# Altium schematic sheet 10.SchDoc
size 297 x 209 mm
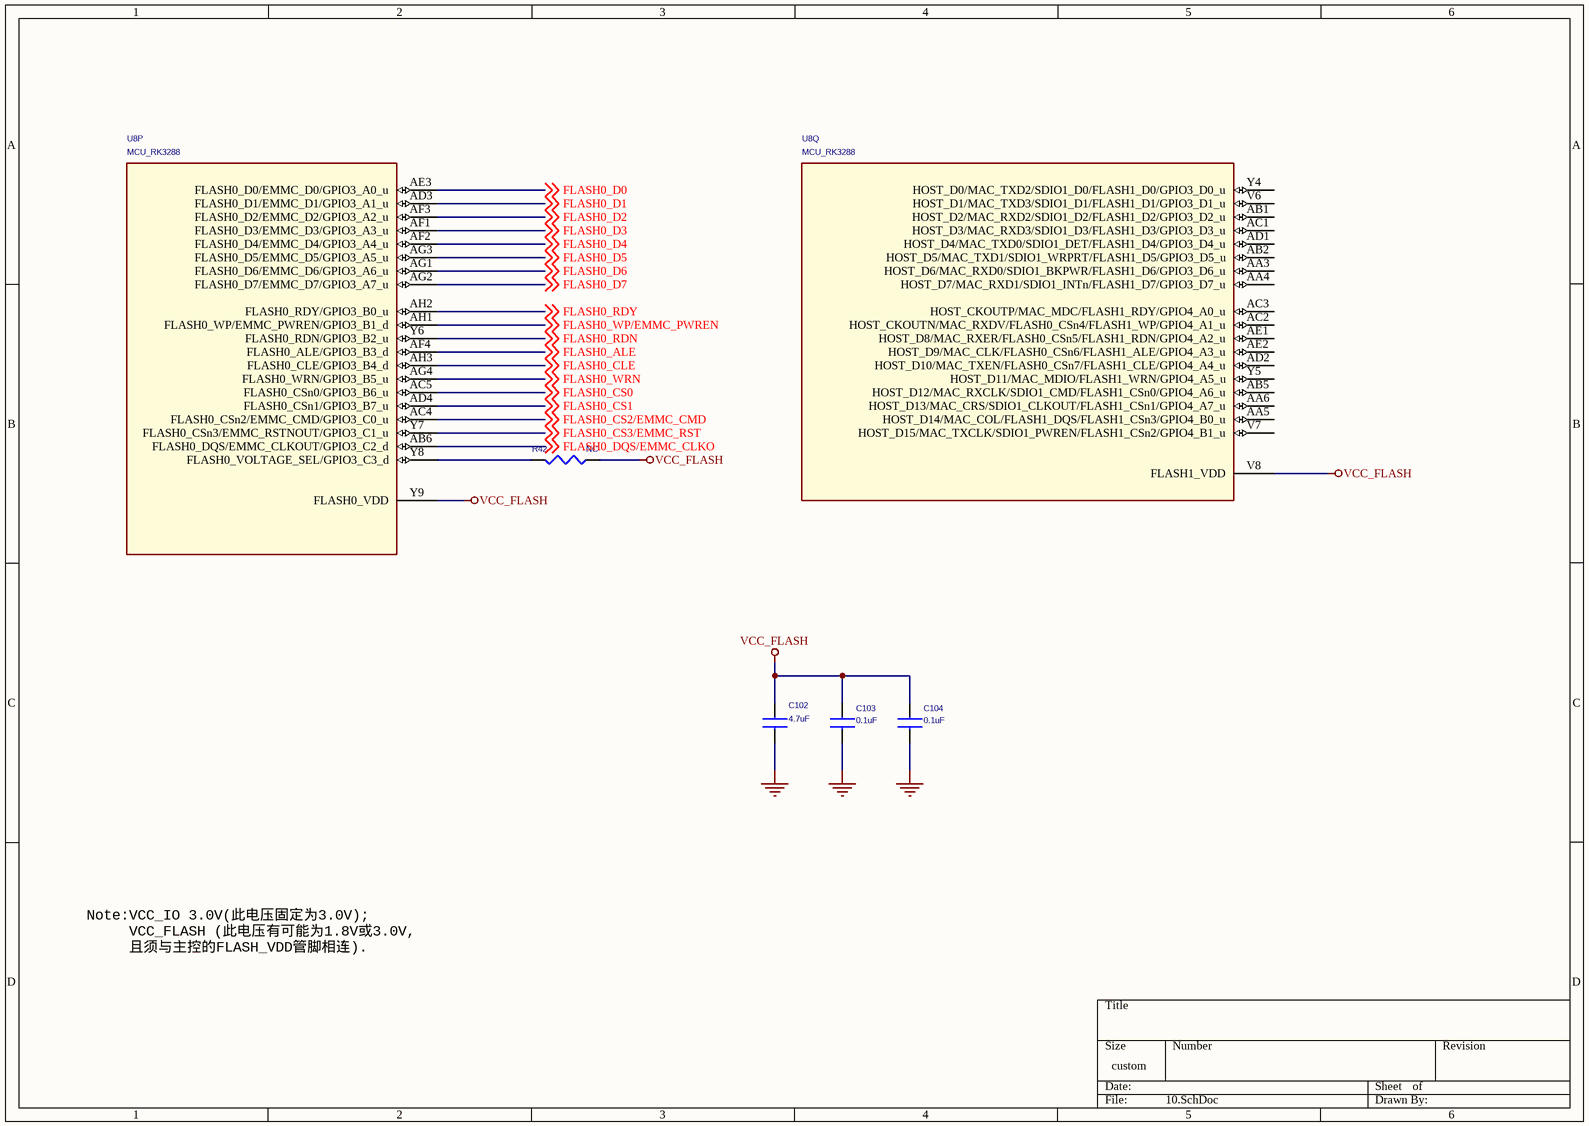
[diagram p0: 10.SchDoc]

## Parts
C102  4.7uF  [C0603]
C103  0.1uF  [C0603]
C104  0.1uF  [C0603]
R42  NC  [r0402]
U8  MCU_RK3288  [BGA453-19X19]  (parts P,Q of 24)

## Nets
GND: C102.2 C103.2 C104.2
VCC_FLASH: C102.1 C103.1 C104.1 R42.1 U8.V8(FLASH1_VDD) U8.Y9(FLASH0_VDD)
FLASH0_ALE: U8.AF4(FLASH0_ALE/GPIO3_B3_d) ; off-sheet FLASH0_ALE
FLASH0_CLE: U8.AH3(FLASH0_CLE/GPIO3_B4_d) ; off-sheet FLASH0_CLE
FLASH0_CS0: U8.AC5(FLASH0_CSn0/GPIO3_B6_u) ; off-sheet FLASH0_CS0
FLASH0_CS1: U8.AD4(FLASH0_CSn1/GPIO3_B7_u) ; off-sheet FLASH0_CS1
FLASH0_CS2/EMMC_CMD: U8.AC4(FLASH0_CSn2/EMMC_CMD/GPIO3_C0_u) ; off-sheet FLASH0_CS2/EMMC_CMD
FLASH0_CS3/EMMC_RST: U8.Y7(FLASH0_CSn3/EMMC_RSTNOUT/GPIO3_C1_u) ; off-sheet FLASH0_CS3/EMMC_RST
FLASH0_D0: U8.AE3(FLASH0_D0/EMMC_D0/GPIO3_A0_u) ; off-sheet FLASH0_D0
FLASH0_D1: U8.AD3(FLASH0_D1/EMMC_D1/GPIO3_A1_u) ; off-sheet FLASH0_D1
FLASH0_D2: U8.AF3(FLASH0_D2/EMMC_D2/GPIO3_A2_u) ; off-sheet FLASH0_D2
FLASH0_D3: U8.AF1(FLASH0_D3/EMMC_D3/GPIO3_A3_u) ; off-sheet FLASH0_D3
FLASH0_D4: U8.AF2(FLASH0_D4/EMMC_D4/GPIO3_A4_u) ; off-sheet FLASH0_D4
FLASH0_D5: U8.AG3(FLASH0_D5/EMMC_D5/GPIO3_A5_u) ; off-sheet FLASH0_D5
FLASH0_D6: U8.AG1(FLASH0_D6/EMMC_D6/GPIO3_A6_u) ; off-sheet FLASH0_D6
FLASH0_D7: U8.AG2(FLASH0_D7/EMMC_D7/GPIO3_A7_u) ; off-sheet FLASH0_D7
FLASH0_DQS/EMMC_CLKO: U8.AB6(FLASH0_DQS/EMMC_CLKOUT/GPIO3_C2_d) ; off-sheet FLASH0_DQS/EMMC_CLKO
FLASH0_RDN: U8.Y6(FLASH0_RDN/GPIO3_B2_u) ; off-sheet FLASH0_RDN
FLASH0_RDY: U8.AH2(FLASH0_RDY/GPIO3_B0_u) ; off-sheet FLASH0_RDY
FLASH0_WP/EMMC_PWREN: U8.AH1(FLASH0_WP/EMMC_PWREN/GPIO3_B1_d) ; off-sheet FLASH0_WP/EMMC_PWREN
FLASH0_WRN: U8.AG4(FLASH0_WRN/GPIO3_B5_u) ; off-sheet FLASH0_WRN
NetR42_2: R42.2 U8.Y8(FLASH0_VOLTAGE_SEL/GPIO3_C3_d)

Not connected (* = marked no-connect by the designer): U8 AA3(HOST_D6/MAC_RXD0/SDIO1_BKPWR/FLASH1_D6/GPIO3_D6_u) AA4(HOST_D7/MAC_RXD1/SDIO1_INTn/FLASH1_D7/GPIO3_D7_u) AA5(HOST_D14/MAC_COL/FLASH1_DQS/FLASH1_CSn3/GPIO4_B0_u) AA6(HOST_D13/MAC_CRS/SDIO1_CLKOUT/FLASH1_CSn1/GPIO4_A7_u) AB1(HOST_D2/MAC_RXD2/SDIO1_D2/FLASH1_D2/GPIO3_D2_u) AB2(HOST_D5/MAC_TXD1/SDIO1_WRPRT/FLASH1_D5/GPIO3_D5_u) AB5(HOST_D12/MAC_RXCLK/SDIO1_CMD/FLASH1_CSn0/GPIO4_A6_u) AC1(HOST_D3/MAC_RXD3/SDIO1_D3/FLASH1_D3/GPIO3_D3_u) AC2(HOST_CKOUTN/MAC_RXDV/FLASH0_CSn4/FLASH1_WP/GPIO4_A1_u) AC3(HOST_CKOUTP/MAC_MDC/FLASH1_RDY/GPIO4_A0_u) AD1(HOST_D4/MAC_TXD0/SDIO1_DET/FLASH1_D4/GPIO3_D4_u) AD2(HOST_D10/MAC_TXEN/FLASH0_CSn7/FLASH1_CLE/GPIO4_A4_u) AE1(HOST_D8/MAC_RXER/FLASH0_CSn5/FLASH1_RDN/GPIO4_A2_u) AE2(HOST_D9/MAC_CLK/FLASH0_CSn6/FLASH1_ALE/GPIO4_A3_u) V6(HOST_D1/MAC_TXD3/SDIO1_D1/FLASH1_D1/GPIO3_D1_u) V7(HOST_D15/MAC_TXCLK/SDIO1_PWREN/FLASH1_CSn2/GPIO4_B1_u) Y4(HOST_D0/MAC_TXD2/SDIO1_D0/FLASH1_D0/GPIO3_D0_u) Y5(HOST_D11/MAC_MDIO/FLASH1_WRN/GPIO4_A5_u)

## Notes on the sheet
- Note:VCC_IO 3.0V(此电压固定为3.0V);
  VCC_FLASH (此电压有可能为1.8V或3.0V,
  且须与主控的FLASH_VDD管脚相连).

## Library data of the parts
C102 = CAP NP_Dup3: 贴片电容
C103 C104 = CAP NP_Dup3: RoHS CHIP CAP 0.1uF +10/-10% X7R
R42 = RESISTOR_1_Dup2
U8 = MCU_RK3288_3